# EAGLE design BeagleWire Debug - CRRYEK (EAGLE 9.1.3)
LICENSE: CERN OHL v1.2; REV: CRRYEK; TITLE: BeagleWire to Debug PMOD; URL: https://github.com/CapableRobot/PMOD-Adapters
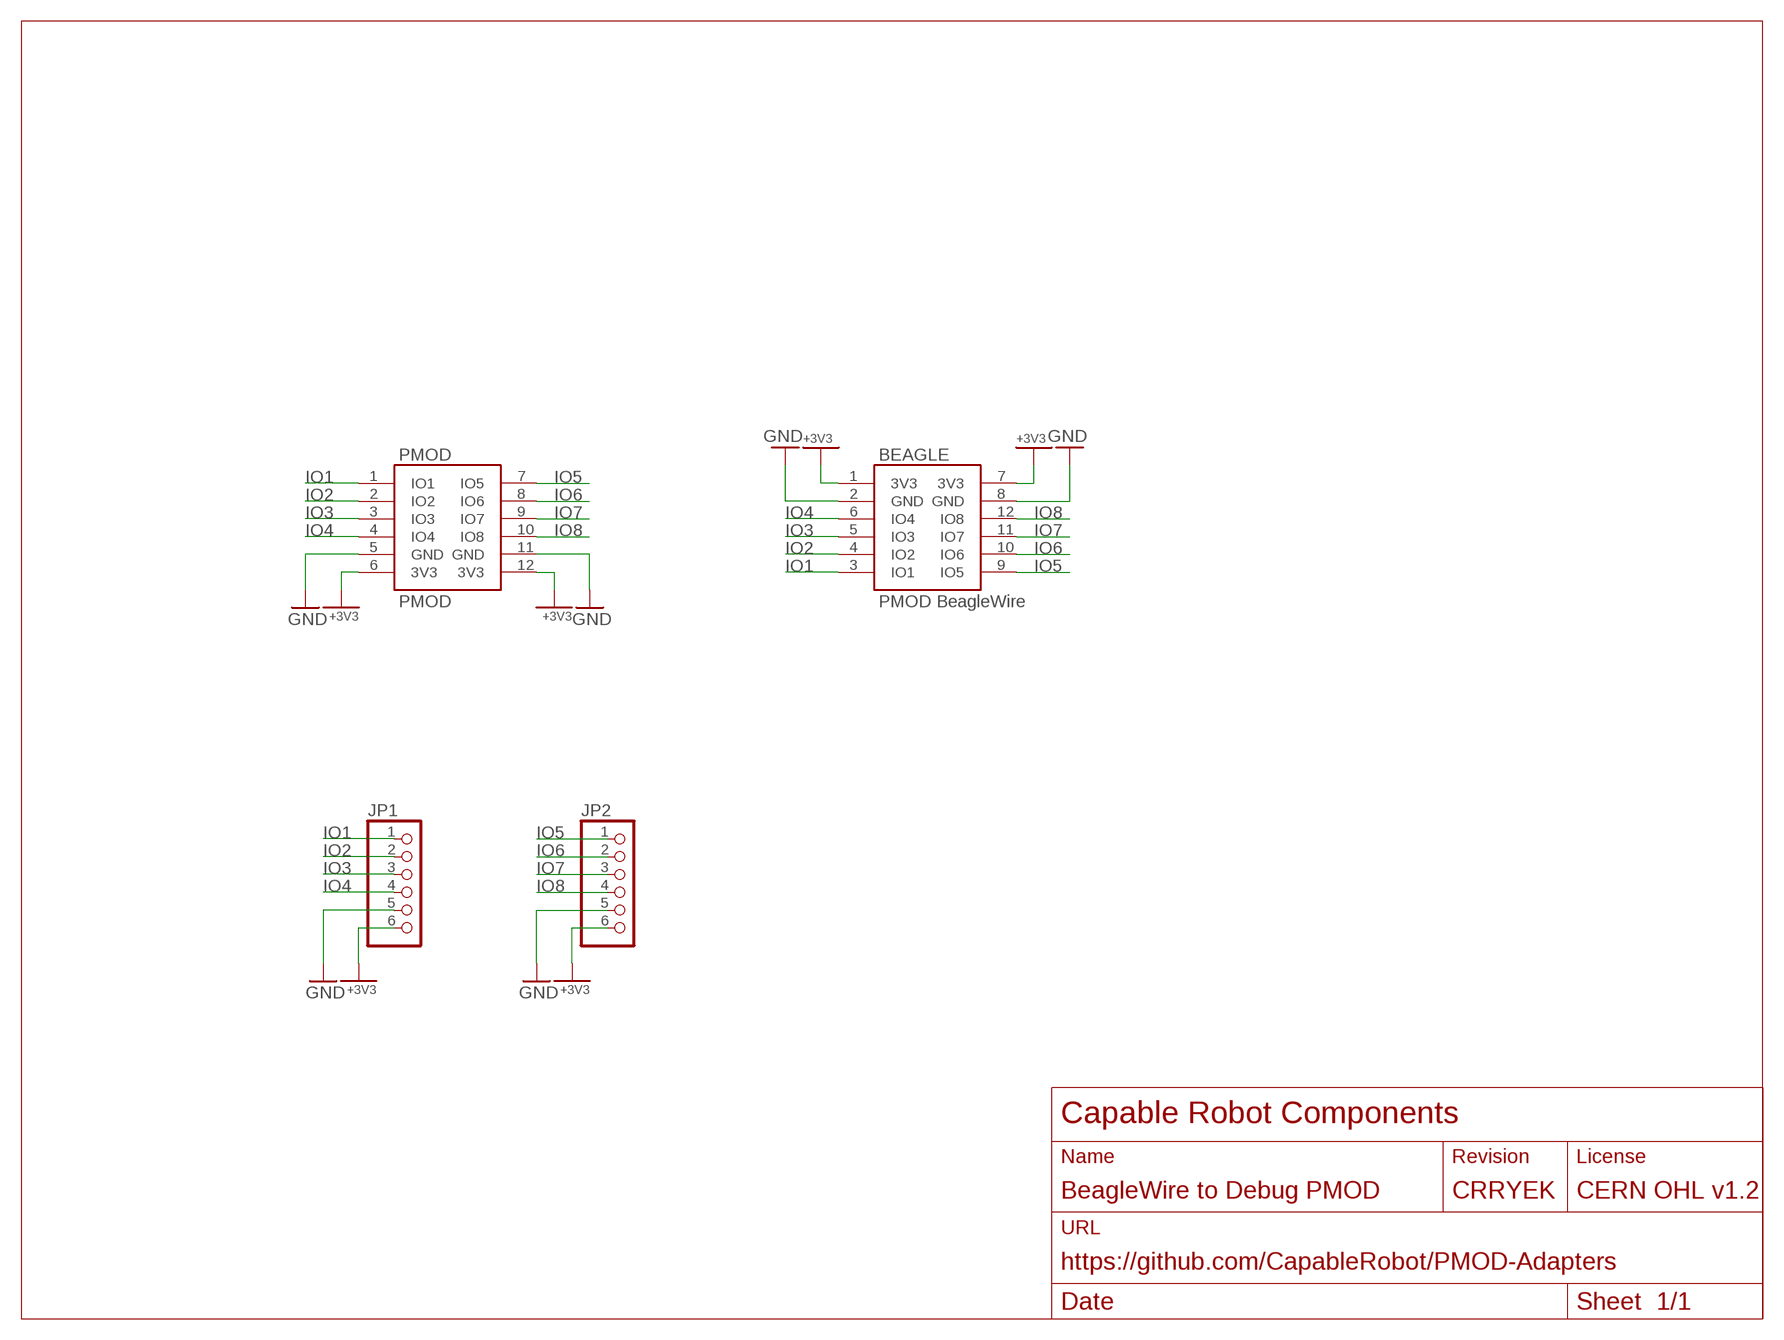
[diagram p0: schematic, sheet 1]

## Parts
BEAGLE  PMOD-BEAGLEWIRE  [HDRRA12W64P254_2X6_1524X254X556B]
JP1  PINHD-1X6  [1X06]
JP2  PINHD-1X6  [1X06]
PMOD  PMOD-HOST  [HDRRAR12W64P254_2X6_1524X736X556B]

## Nets
+3V3: BEAGLE.1(3V3) BEAGLE.7(3V3) JP1.6 JP2.6 PMOD.6(3V3) PMOD.12(3V3)
GND: BEAGLE.2(GND) BEAGLE.8(GND) JP1.5 JP2.5 PMOD.5(GND) PMOD.11(GND)
IO1: BEAGLE.3(IO1) JP1.1 PMOD.1(IO1)
IO2: BEAGLE.4(IO2) JP1.2 PMOD.2(IO2)
IO3: BEAGLE.5(IO3) JP1.3 PMOD.3(IO3)
IO4: BEAGLE.6(IO4) JP1.4 PMOD.4(IO4)
IO5: BEAGLE.9(IO5) JP2.1 PMOD.7(IO5)
IO6: BEAGLE.10(IO6) JP2.2 PMOD.8(IO6)
IO7: BEAGLE.11(IO7) JP2.3 PMOD.9(IO7)
IO8: BEAGLE.12(IO8) JP2.4 PMOD.10(IO8)

## Library data of the parts
BEAGLE = CapableRobot:PMOD-BEAGLEWIRE
JP1 JP2 = adafruit:PINHD-1X6: PIN HEADER
PMOD = CapableRobot:PMOD

## Board
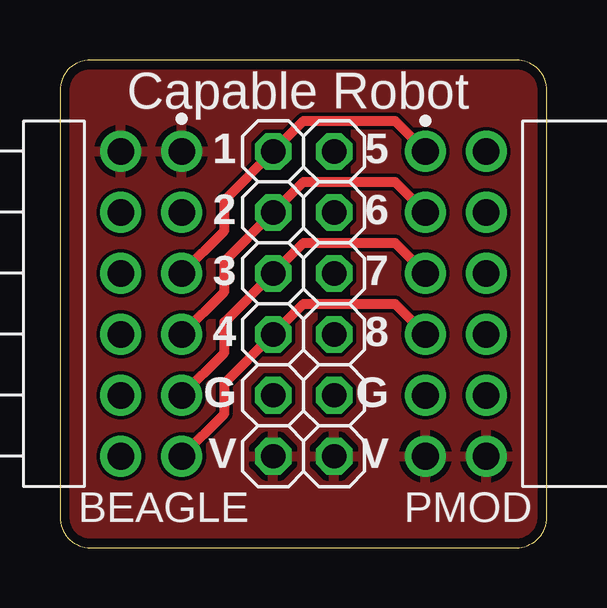
[diagram p1: board, top side]
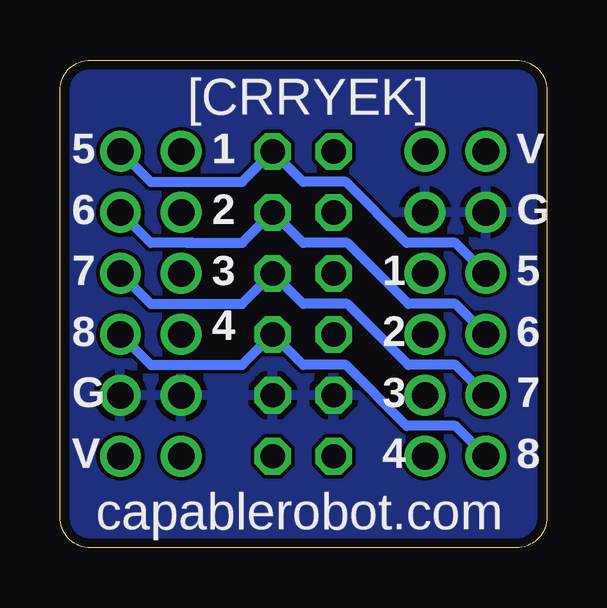
[diagram p2: board, bottom side, seen from below]

Size 20.3 x 20.32 mm. Coordinates in mm from the lower left corner, seen from the top.
Outline: 19.03,20.32 1.27,20.32 arc90 0,19.05 0,1.27 arc90 1.27,0 19.03,0 arc90 20.3,1.27 20.3,19.05 arc90 19.03,20.32
Copper layers (1*16): Top 0.035559375mm / dielectric 1.6mm / Bottom 0.035559375mm
Design rules "oshpark-2layer": minimum track width 6mil, minimum drill 10mil, track to track 6mil, track to pad 6mil, pad to pad 6mil, via to via 6mil, smd to smd 6mil, copper to edge 15mil, drill to drill 6mil, minimum pad ring 5mil, minimum via ring 5mil, stop-mask expansion 2.5mil, vias tented up to drill 0mil, thermal gap 10mil

### Footprints (pad centres in the part's own frame; a part is rotated, then mirrored left to right if it is on the bottom)
HDRRA12W64P254_2X6_1524X254X556B = drill 1.105 pad 1.705: 1 0,0; 2 2.54,0; 3 5.08,0; 4 7.62,0; 5 10.16,0; 6 12.7,0; 7 0,-2.54; 8 2.54,-2.54; 9 5.08,-2.54; 10 7.62,-2.54; 11 10.16,-2.54; 12 12.7,-2.54
1X06 = drill 1.016 octagon: 1 -6.35,0; 2 -3.81,0; 3 -1.27,0; 4 1.27,0; 5 3.81,0; 6 6.35,0
HDRRAR12W64P254_2X6_1524X736X556B = drill 1.105 pad 1.705: 1 12.7,0; 2 10.16,0; 3 7.62,0; 4 5.08,0; 5 2.54,0; 6 0,0; 7 12.7,-2.54; 8 10.16,-2.54; 9 7.62,-2.54; 10 5.08,-2.54; 11 2.54,-2.54; 12 0,-2.54

### Placement (x,y rotation side)
BEAGLE  5.08,16.51 270 top
JP1  8.89,10.16 270 top
JP2  11.43,10.16 270 top
PMOD  15.24,3.81 90 top

### Tracks (layer width: path | path; a pad name or v marks a point on that pad's centre or on a via)
+3V3
  pour Top: 0,20.32 20.32,20.32 20.32,0 0,0
GND
  pour Bottom: 0,20.32 20.32,20.32 20.32,0 0,0
IO1
  Top 0.406: BEAGLE.3 6.86,13.21 6.86,14.48 JP1.1 10.16,17.78 13.97,17.78 PMOD.1
IO2
  Top 0.406: BEAGLE.4 6.86,10.67 6.86,11.94 JP1.2 10.16,15.24 13.97,15.24 PMOD.2
IO3
  Top 0.406: BEAGLE.5 6.86,8.13 6.86,9.4 JP1.3 10.16,12.7 13.97,12.7 PMOD.3
IO4
  Top 0.406: BEAGLE.6 6.86,5.59 6.86,6.86 JP1.4 10.16,10.16 13.97,10.16 PMOD.4
IO5
  Bottom 0.406: BEAGLE.9 3.81,12.7 5.84,12.7 8.38,15.24 10.16,15.24 JP2.1 12.7,15.24 16.51,15.24 PMOD.7
IO6
  Bottom 0.406: BEAGLE.10 3.81,10.16 5.77,10.16 8.31,12.7 10.16,12.7 JP2.2 12.7,12.7 14.99,12.7 | PMOD.8 16.51,12.7 14.99,12.7 | 14.73,12.7 14.99,12.7
IO7
  Bottom 0.406: BEAGLE.11 3.81,7.62 5.77,7.62 8.31,10.16 10.16,10.16 JP2.3 12.7,10.16 16.51,10.16 PMOD.9
IO8
  Bottom 0.406: BEAGLE.12 3.81,5.08 5.84,5.08 8.38,7.62 10.16,7.62 JP2.4 12.7,7.62 16.51,7.62 PMOD.10

### Text on the board
tPlace: Capable Robot | 1 | 5 | 2 | 6 | 3 | 7 | 4 | 8 | G | G | V | V
bPlace: [CRRYEK] | V | 1 | 5 | G | 2 | 6 | 5 | 1 | 3 | 7 | 4 | 6 | 2 | 8 | 7 | 3 | G | 8 | 4 | V | capablerobot.com